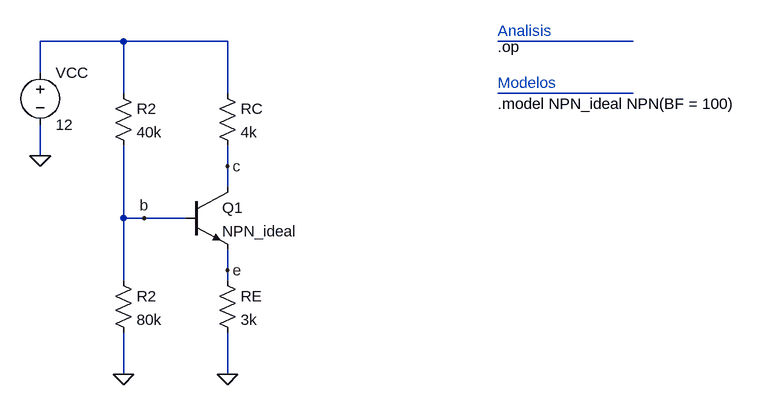
[diagram p0: schematic example1_design1.asc]
example1_design1.asc, the LTspice schematic file:
Version 4
SHEET 1 916 680
WIRE -336 -256 -464 -256
WIRE -176 -256 -336 -256
WIRE 448 -256 240 -256
WIRE -464 -208 -464 -256
WIRE -336 -176 -336 -256
WIRE -176 -176 -176 -256
WIRE 448 -176 240 -176
WIRE -464 -80 -464 -128
WIRE -176 -64 -176 -96
WIRE -176 -32 -176 -64
WIRE -336 16 -336 -96
WIRE -304 16 -336 16
WIRE -240 16 -304 16
WIRE -176 96 -176 64
WIRE -336 112 -336 16
WIRE -176 112 -176 96
WIRE -336 256 -336 192
WIRE -176 256 -176 192
FLAG -464 -80 0
FLAG -336 256 0
FLAG -304 16 b
FLAG -176 -64 c
FLAG -176 96 e
FLAG -176 256 0
SYMBOL npn -240 -32 R0
SYMATTR InstName Q1
SYMATTR Value NPN_ideal
SYMBOL res -352 96 R0
SYMATTR InstName R2
SYMATTR Value 80k
SYMBOL res -192 -192 R0
SYMATTR InstName RC
SYMATTR Value 4k
SYMBOL voltage -464 -224 R0
WINDOW 123 0 0 Left 0
WINDOW 39 0 0 Left 0
SYMATTR InstName VCC
SYMATTR Value 12
SYMBOL res -192 96 R0
SYMATTR InstName RE
SYMATTR Value 3k
SYMBOL res -352 -192 R0
SYMATTR InstName R2
SYMATTR Value 40k
TEXT 240 -272 Left 2 ;Analisis
TEXT 240 -248 Left 2 !.op
TEXT 240 -160 Left 2 !.model NPN_ideal NPN(BF = 100)
TEXT 240 -192 Left 2 ;Modelos

The netlist it stands for:
* example1_design1.asc
Q1 c b e 0 NPN_ideal
R2 b 0 80k
RC N001 c 4k
VCC N001 0 12
RE e 0 3k
R2 N001 b 40k
.model NPN NPN
.model PNP PNP
.lib standard.bjt
* Analisis
.op
.model NPN_ideal NPN(BF = 100)
* Modelos
.backanno
.end